# EAGLE schematic untitled (EAGLE 5.06)
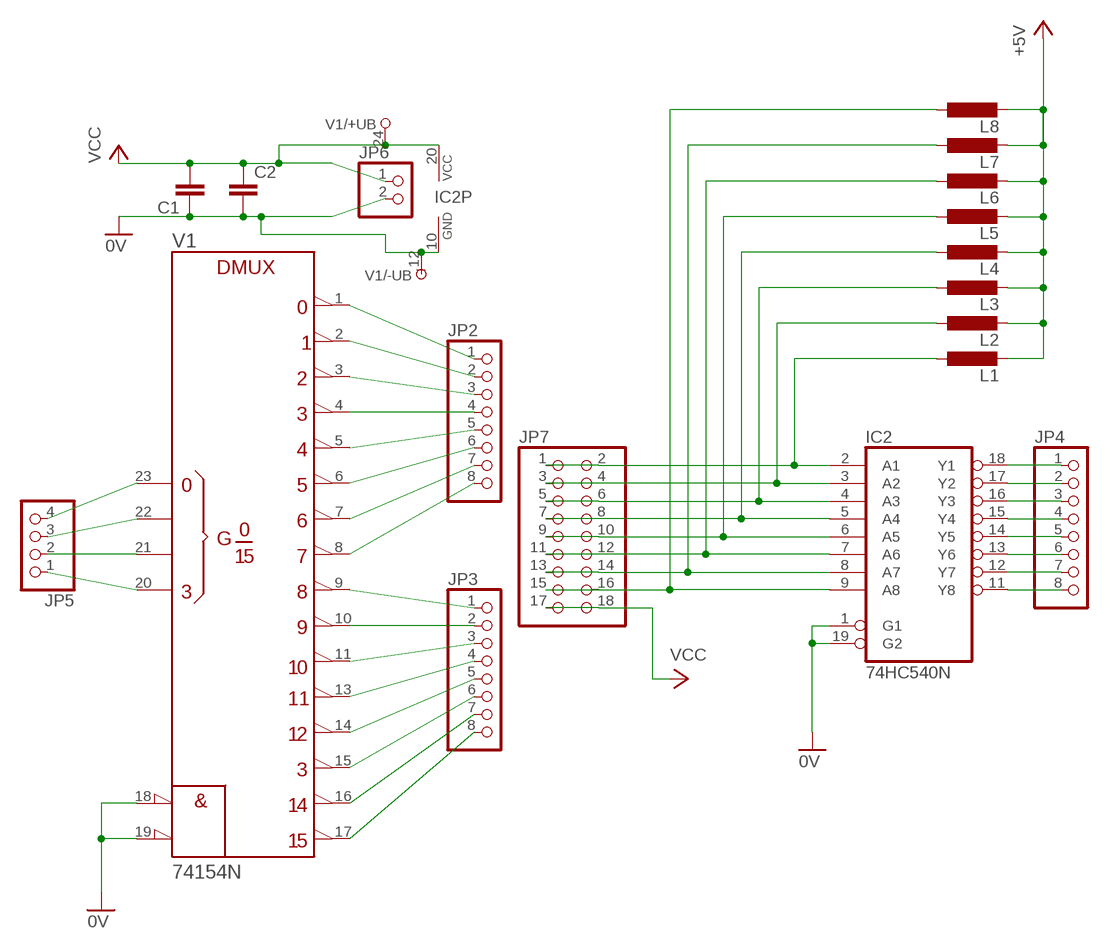
[diagram p0: schematic, sheet 1]

## Parts
C1  C-EU050-025X075  [C050-025X075]
C2  C-EU050-025X075  [C050-025X075]
IC2  74HC540N  [DIL20]
JP2  PINHD-1X8  [1X08]
JP3  PINHD-1X8  [1X08]
JP4  PINHD-1X8  [1X08]
JP5  PINHD-1X4  [1X04]
JP6  PINHD-1X2  [1X02]
JP7  PINHD-2X9  [2X09]
L1  L-EU0207/10  [0207/10]
L2  L-EU0207/10  [0207/10]
L3  L-EU0207/10  [0207/10]
L4  L-EU0207/10  [0207/10]
L5  L-EU0207/10  [0207/10]
L6  L-EU0207/10  [0207/10]
L7  L-EU0207/10  [0207/10]
L8  L-EU0207/10  [0207/10]
V1  74154N  [DIL24-3]

## Nets
0V: C1.1 C2.2 IC2.1(G1) IC2.10(GND) IC2.19(G2) JP6.2 V1.12(-UB) V1.18(!G1) V1.19(!G2)
+5V: L1.2 L2.2 L3.2 L4.2 L5.2 L6.2 L7.2 L8.2
N$1: JP5.4 V1.23(A)
N$2: JP5.3 V1.22(B)
N$3: JP5.2 V1.21(C)
N$4: JP5.1 V1.20(D)
N$5: JP2.1 V1.1
N$6: JP2.2 V1.2
N$7: JP2.3 V1.3
N$8: JP2.4 V1.4
N$9: JP2.5 V1.5
N$10: JP2.6 V1.6
N$11: JP2.7 V1.7
N$12: JP2.8 V1.8
N$13: JP3.1 V1.9
N$14: JP3.2 V1.10
N$15: JP3.3 V1.11
N$16: JP3.4 V1.13
N$17: JP3.5 V1.14
N$18: JP3.6 V1.15
N$19: JP3.7 V1.16
N$20: JP3.8 V1.17
N$22: IC2.2(A1) JP7.1 JP7.2 L1.1
N$23: IC2.3(A2) JP7.3 JP7.4 L2.1
N$24: IC2.5(A4) JP7.7 JP7.8 L4.1
N$25: IC2.6(A5) JP7.9 JP7.10 L5.1
N$26: IC2.7(A6) JP7.11 JP7.12 L6.1
N$27: IC2.8(A7) JP7.13 JP7.14 L7.1
N$28: IC2.9(A8) JP7.15 JP7.16 L8.1
N$29: IC2.18(Y1) JP4.1
N$30: IC2.17(Y2) JP4.2
N$31: IC2.16(Y3) JP4.3
N$32: IC2.15(Y4) JP4.4
N$33: IC2.14(Y5) JP4.5
N$34: IC2.13(Y6) JP4.6
N$35: IC2.12(Y7) JP4.7
N$36: IC2.11(Y8) JP4.8
N$38: IC2.4(A3) JP7.5 JP7.6 L3.1
VCC: C1.2 C2.1 IC2.20(VCC) JP6.1 JP7.17 JP7.18 V1.24(+UB)

## Library data of the parts
C1 C2 = resistor:C-EU: CAPACITOR, European symbol
IC2 = 74xx-eu:74*540: Octal BUFFER and LINE DRIVER, 3-state
JP2-JP4 = pinhead:PINHD-1X8: PIN HEADER
JP5 = pinhead:PINHD-1X4: PIN HEADER
JP6 = pinhead:PINHD-1X2: PIN HEADER
JP7 = pinhead:PINHD-2X9: PIN HEADER
L1-L8 = resistor:L-EU: INDUCTOR, European symbol
V1 = 74ttl-din:74*154: 4-line to 16-line data SELECTOR/MULTIPLEXER